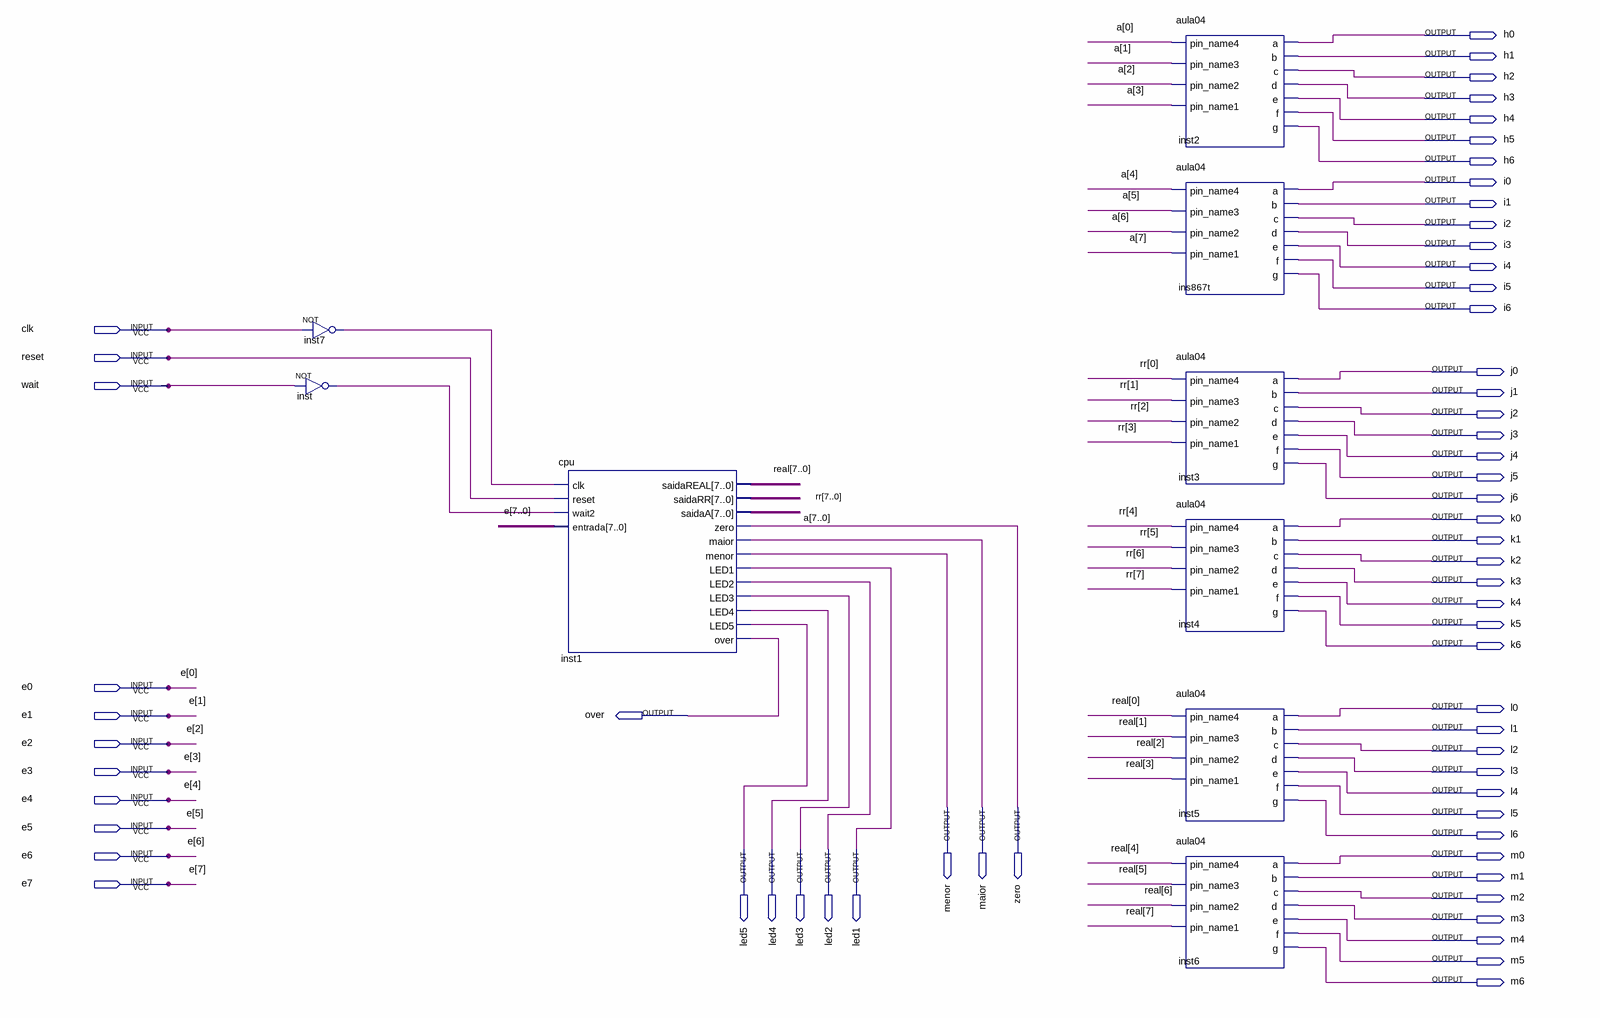
[diagram p0: schematic sheet]
// Quartus schematic motherboard.bdf as structural Verilog: 9 symbols, 62 pins
module motherboard (
  input  clk,
  input  reset,
  input  \wait ,
  input  e0,
  input  e1,
  input  e2,
  input  e3,
  input  e4,
  input  e5,
  input  e6,
  input  e7,
  output h0,
  output h1,
  output h2,
  output h3,
  output h4,
  output h5,
  output h6,
  output i0,
  output i1,
  output i2,
  output i3,
  output i4,
  output i5,
  output i6,
  output j0,
  output j1,
  output j2,
  output j3,
  output j4,
  output j5,
  output j6,
  output k0,
  output k1,
  output k2,
  output k3,
  output k4,
  output k5,
  output k6,
  output l0,
  output over,
  output l1,
  output l2,
  output l3,
  output l4,
  output menor,
  output maior,
  output zero,
  output l5,
  output l6,
  output led5,
  output led4,
  output led3,
  output led2,
  output led1,
  output m0,
  output m1,
  output m2,
  output m3,
  output m4,
  output m5,
  output m6
);

  wire inst7_out, inst_out;
  wire [7:0] a, \real , rr;

  not inst (inst_out, \wait );
  not inst7 (inst7_out, clk);
  cpu inst1 (
    .clk(inst7_out), .reset(reset), .wait2(inst_out), .entrada({e7, e6, e5, e4, e3, e2, e1, e0}),
    .saidaREAL(\real ), .saidaRR(rr), .saidaA(a), .zero(zero), .maior(maior), .menor(menor), .LED1(led1),
    .LED2(led2), .LED3(led3), .LED4(led4), .LED5(led5), .over(over));
  aula04 inst2 (
    .pin_name1(a[3]), .pin_name4(a[0]), .pin_name2(a[2]), .pin_name3(a[1]), .a(h0), .b(h1), .c(h2), .d(h3),
    .e(h4), .f(h5), .g(h6));
  aula04 ins867t (
    .pin_name1(a[7]), .pin_name4(a[4]), .pin_name2(a[6]), .pin_name3(a[5]), .a(i0), .b(i1), .c(i2), .d(i3),
    .e(i4), .f(i5), .g(i6));
  aula04 inst3 (
    .pin_name1(rr[3]), .pin_name4(rr[0]), .pin_name2(rr[2]), .pin_name3(rr[1]), .a(j0), .b(j1), .c(j2),
    .d(j3), .e(j4), .f(j5), .g(j6));
  aula04 inst4 (
    .pin_name1(rr[7]), .pin_name4(rr[4]), .pin_name2(rr[6]), .pin_name3(rr[5]), .a(k0), .b(k1), .c(k2),
    .d(k3), .e(k4), .f(k5), .g(k6));
  aula04 inst5 (
    .pin_name1(\real [3]), .pin_name4(\real [0]), .pin_name2(\real [2]), .pin_name3(\real [1]), .a(l0),
    .b(l1), .c(l2), .d(l3), .e(l4), .f(l5), .g(l6));
  aula04 inst6 (
    .pin_name1(\real [7]), .pin_name4(\real [4]), .pin_name2(\real [6]), .pin_name3(\real [5]), .a(m0),
    .b(m1), .c(m2), .d(m3), .e(m4), .f(m5), .g(m6));
endmodule
